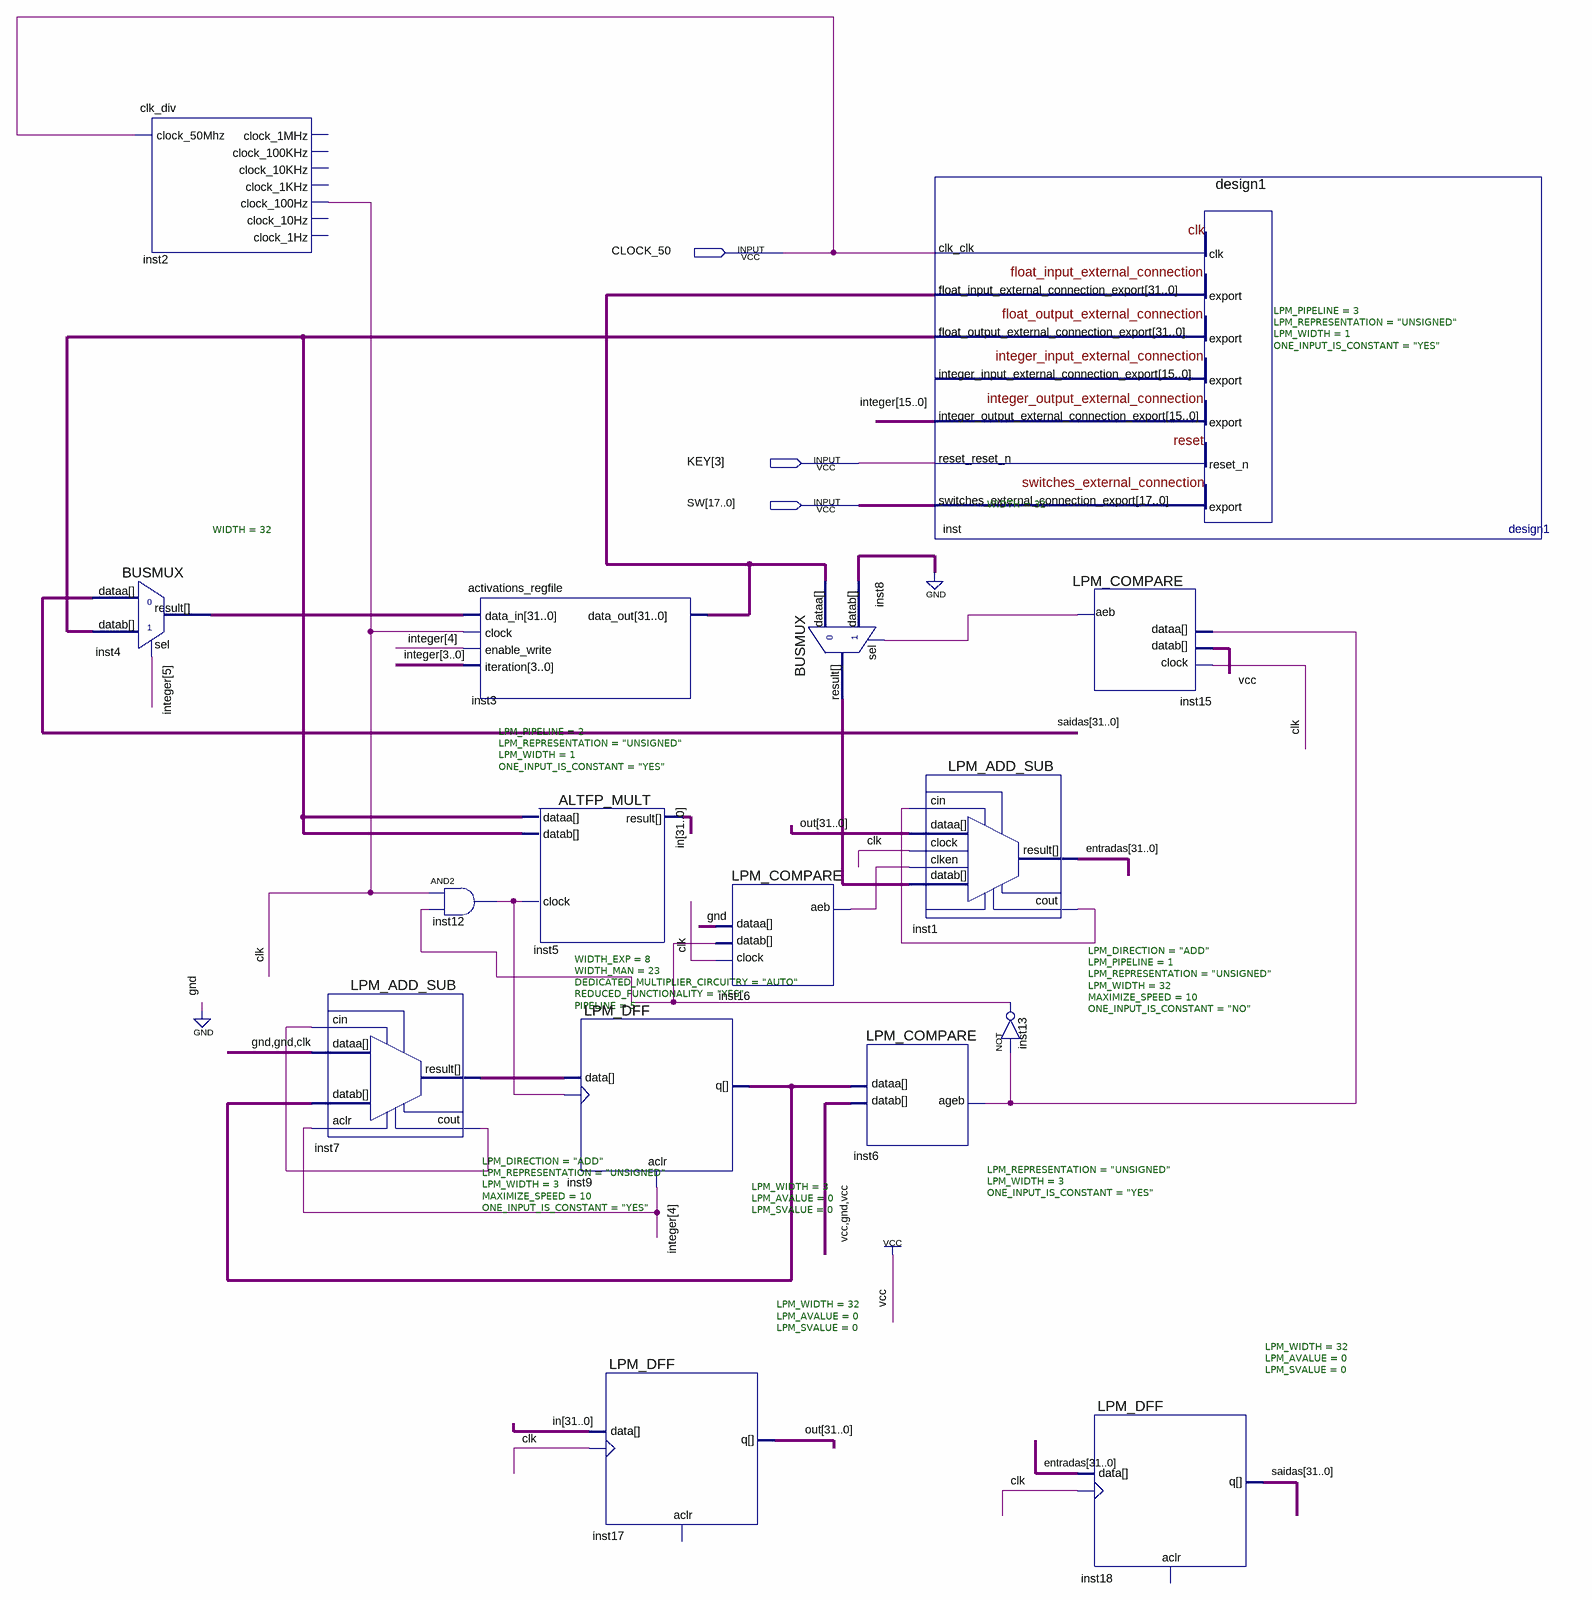
[diagram p0: schematic sheet]
// Quartus schematic toplevelblock.bdf as structural Verilog: 16 symbols, 3 pins
module toplevelblock (
  input  CLOCK_50,
  input  [3:3] KEY,
  input  [17:0] SW
);

  wire clk, inst1_cout, inst6_ageb, inst7_cout, inst12_out, inst13_out, inst15_aeb, inst16_aeb;
  wire [2:0] inst7_result, inst9_q;
  wire [15:0] \integer ;
  wire [31:0] entradas, in, inst3_data_out, inst4_result, inst8_result,
       inst_float_output_external_connection_export, out, saidas;

  clk_div inst2 (
    .clock_50Mhz(CLOCK_50), .clock_100Hz(clk));  // open: clock_1MHz, clock_100KHz, clock_10KHz, clock_1KHz, clock_10Hz, clock_1Hz
  BUSMUX #(.WIDTH(32)) inst4 (
    .datab(inst_float_output_external_connection_export), .sel(\integer [5]), .dataa(saidas),
    .result(inst4_result));
  LPM_ADD_SUB #(.LPM_DIRECTION("ADD"), .LPM_REPRESENTATION("UNSIGNED"), .LPM_WIDTH(3), .MAXIMIZE_SPEED(10), .ONE_INPUT_IS_CONSTANT("YES")) inst7 (
    .aclr(\integer [4]), .cin(inst7_cout), .dataa({2'b00, clk}), .datab(inst9_q), .cout(inst7_cout),
    .result(inst7_result));
  activations_regfile inst3 (
    .data_in(inst4_result), .clock(clk), .enable_write(\integer [4]), .iteration(\integer [3:0]),
    .data_out(inst3_data_out));
  and inst12 (inst12_out, clk, inst13_out);
  ALTFP_MULT #(.WIDTH_EXP(8), .WIDTH_MAN(23), .DEDICATED_MULTIPLIER_CIRCUITRY("AUTO"), .REDUCED_FUNCTIONALITY("YES"), .PIPELINE(5)) inst5 (
    .clock(inst12_out), .dataa(inst_float_output_external_connection_export),
    .datab(inst_float_output_external_connection_export), .result(in));
  LPM_DFF #(.LPM_WIDTH(3), .LPM_AVALUE(0), .LPM_SVALUE(0)) inst9 (
    .aclr(\integer [4]), .clock(inst12_out), .data(inst7_result), .q(inst9_q));
  LPM_DFF #(.LPM_WIDTH(32), .LPM_AVALUE(0), .LPM_SVALUE(0)) inst17 (.clock(clk), .data(in), .q(out));  // open: aclr
  LPM_COMPARE #(.LPM_PIPELINE(2), .LPM_REPRESENTATION("UNSIGNED"), .LPM_WIDTH(1), .ONE_INPUT_IS_CONSTANT("YES")) inst16 (
    .clock(clk), .dataa(1'b0), .datab(inst13_out), .aeb(inst16_aeb));
  BUSMUX #(.WIDTH(32)) inst8 (.datab({32{1'b0}}), .sel(inst15_aeb), .dataa(inst3_data_out), .result(inst8_result));
  LPM_COMPARE #(.LPM_REPRESENTATION("UNSIGNED"), .LPM_WIDTH(3), .ONE_INPUT_IS_CONSTANT("YES")) inst6 (
    .dataa(inst9_q), .datab(3'b101), .ageb(inst6_ageb));
  design1 inst (
    .clk_clk(CLOCK_50), .float_input_external_connection_export(inst3_data_out), .reset_reset_n(KEY[3]),
    .switches_external_connection_export(SW),
    .float_output_external_connection_export(inst_float_output_external_connection_export),
    .integer_output_external_connection_export(\integer ));  // open: integer_input_external_connection_export
  LPM_ADD_SUB #(.LPM_DIRECTION("ADD"), .LPM_PIPELINE(1), .LPM_REPRESENTATION("UNSIGNED"), .LPM_WIDTH(32), .MAXIMIZE_SPEED(10), .ONE_INPUT_IS_CONSTANT("NO")) inst1 (
    .cin(inst1_cout), .clken(inst16_aeb), .clock(clk), .dataa(out), .datab(inst8_result), .cout(inst1_cout),
    .result(entradas));
  not inst13 (inst13_out, inst6_ageb);
  LPM_COMPARE #(.LPM_PIPELINE(3), .LPM_REPRESENTATION("UNSIGNED"), .LPM_WIDTH(1), .ONE_INPUT_IS_CONSTANT("YES")) inst15 (
    .clock(clk), .dataa(inst6_ageb), .datab(1'b1), .aeb(inst15_aeb));
  LPM_DFF #(.LPM_WIDTH(32), .LPM_AVALUE(0), .LPM_SVALUE(0)) inst18 (
    .clock(clk), .data(entradas), .q(saidas));  // open: aclr
endmodule
